# EAGLE schematic VDA (EAGLE 9.6.2)

## Sheet 1 of 5: Isolated USB-UART Bridge
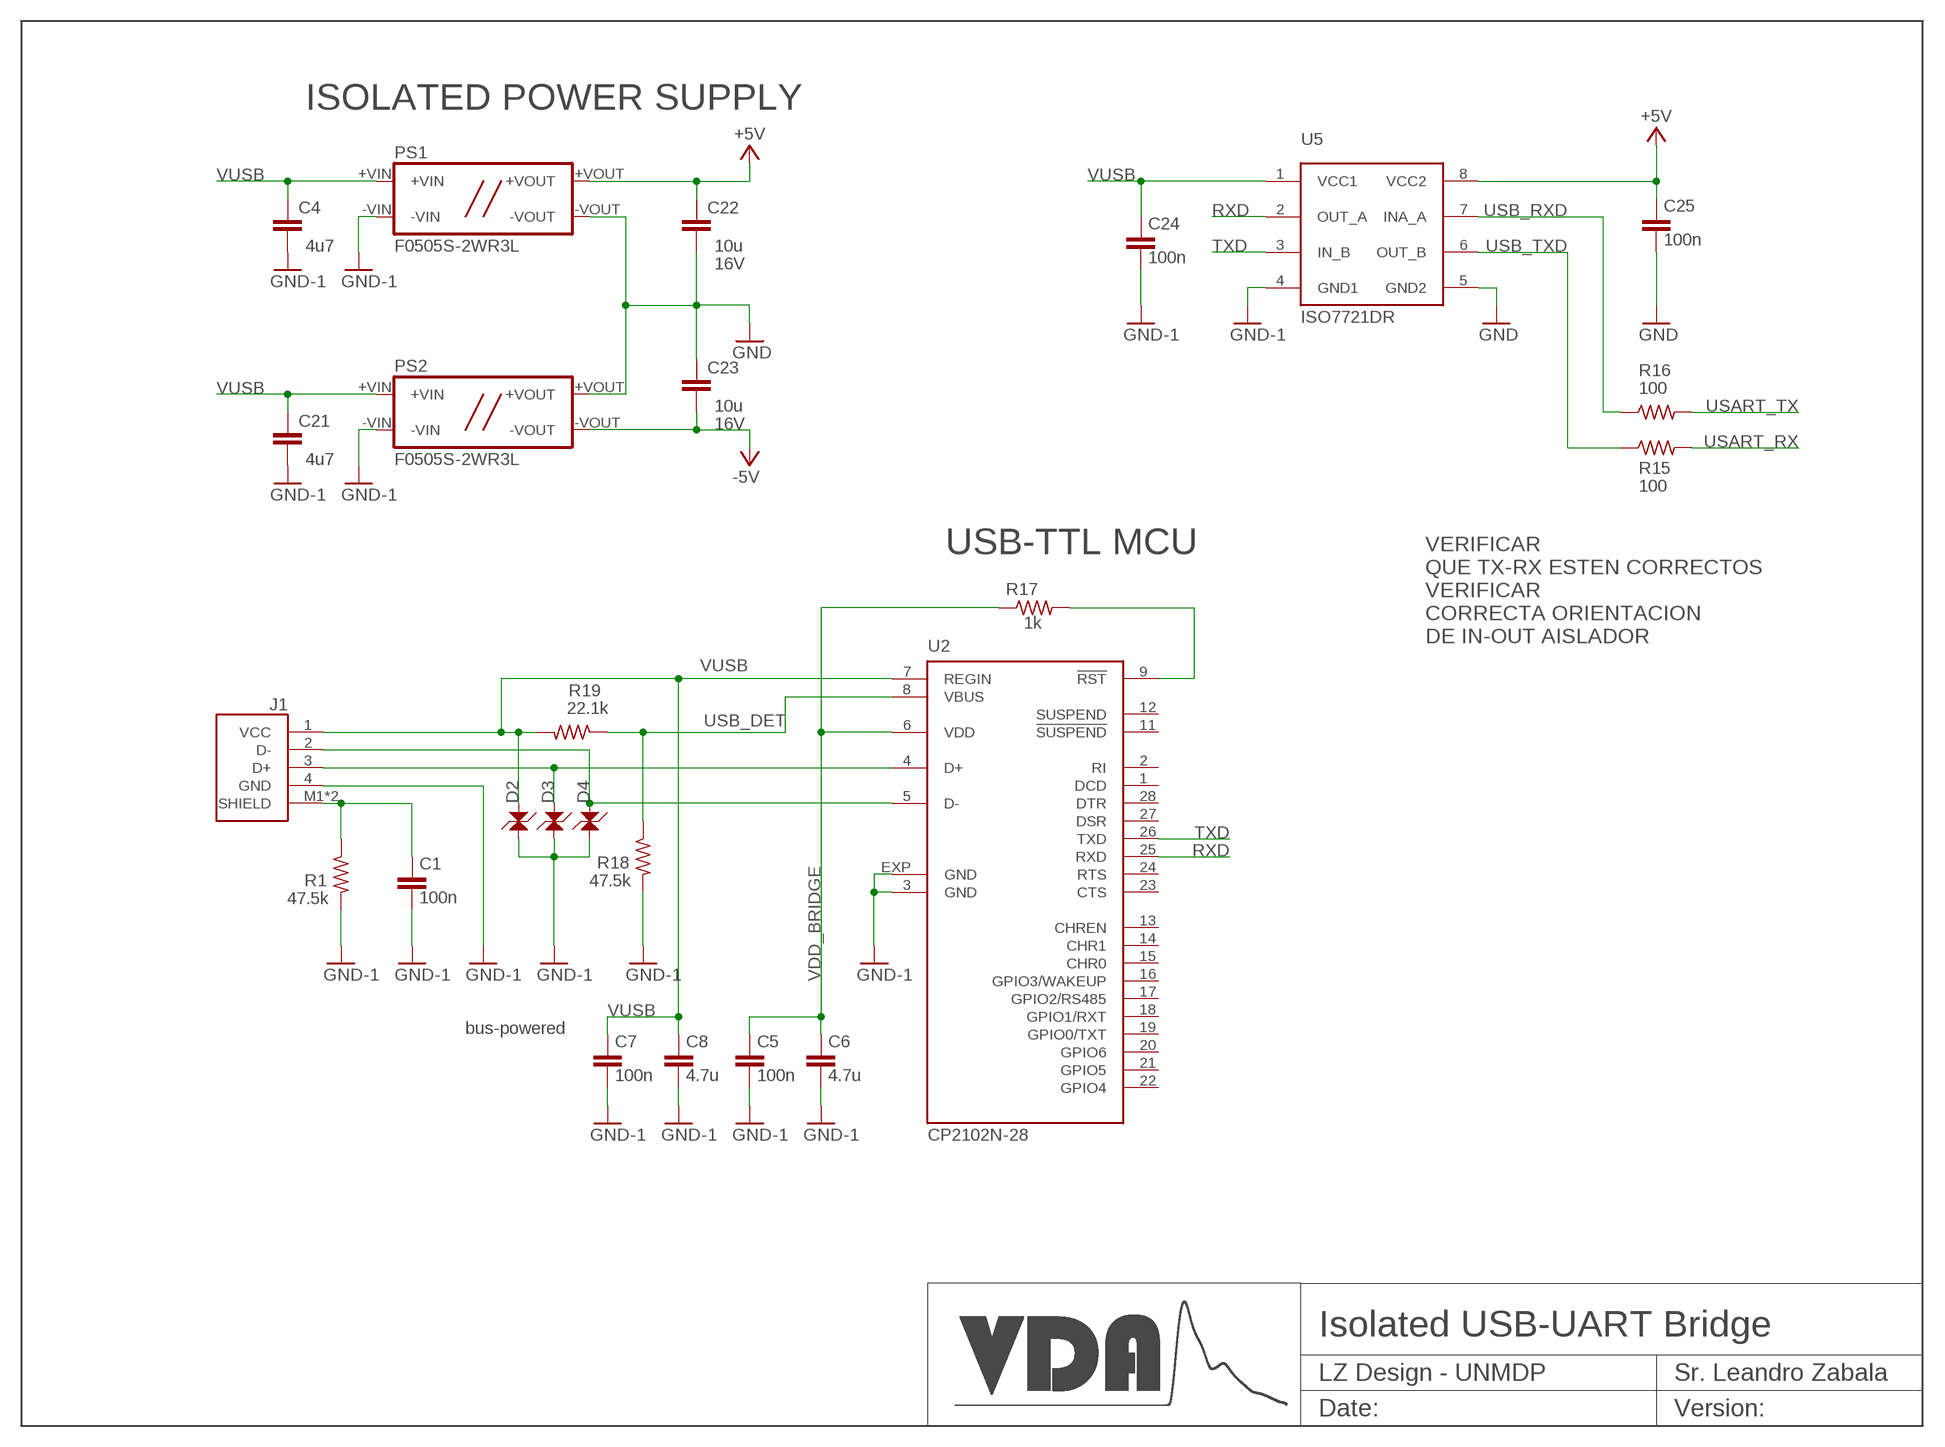
[diagram p0: schematic, sheet 1]

### Parts
C1  100n  C_0603  [C_0603]
C4  4u7  C_0603  [C_0603]
C5  100n  C_0603  [C_0603]
C6  4.7u  C_0805  [C_0805]
C7  100n  C_0603  [C_0603]
C8  4.7u  C_0805  [C_0805]
C21  4u7  C_0603  [C_0603]
C22  10u  C_0603  [C_0603]
C23  10u  C_0603  [C_0603]
C24  100n  C_0603  [C_0603]
C25  100n  C_0603  [C_0603]
D2  LESD5D5.0CT1G  [SOD523]
D3  LESD5D5.0CT1G  [SOD523]
D4  LESD5D5.0CT1G  [SOD523]
J1  USB-2.0  [USB-B]
PS1  F0505S-2WR3L  ISOLATED_DCDC  [0505S-2WR3]
PS2  F0505S-2WR3L  ISOLATED_DCDC  [0505S-2WR3]
R1  47.5k  R-US_R0402  [R0402]
R15  100  R_0603  [R_0603]
R16  100  R_0603  [R_0603]
R17  1k  R-US_R0402  [R0402]
R18  47.5k  R-US_R0402  [R0402]
R19  22.1k  R-US_R0402  [R0402]
U2  CP2102N-28  [MLP28]
U5  ISO7721DR  [SO8]

### Nets
+5V: C22.P$1 C25.P$1 PS1.+VOUT U5.8(VCC2) ; also sheet 2,4
-5V: C23.P$2 PS2.-VOUT ; also sheet 4
GND: C22.P$2 C23.P$1 C25.P$2 PS1.-VOUT PS2.+VOUT U5.5(GND2) ; also sheet 2,3,4
GND-1: C1.P$2 C4.P$2 C5.P$2 C6.P$2 C7.P$2 C8.P$2 C21.P$2 C24.P$2 D2.C D3.C D4.C J1.4(GND) PS1.-VIN PS2.-VIN R1.2 R18.2 U2.3(GND) U2.EXP(GND) U5.4(GND1)
N$54: R17.2 U2.9(!RST)
RXD: U2.25(RXD) U5.2(OUT_A)
SHIELD: C1.P$1 J1.M1(SHIELD) J1.M2(SHIELD) R1.1
TXD: U2.26(TXD) U5.3(IN_B)
USART_RX: R15.2 ; also sheet 3
USART_TX: R16.2 ; also sheet 3
USB_DET: R18.1 R19.1 U2.8(VBUS)
USB_DN: D4.A J1.2(D-) U2.5(D-)
USB_DP: D3.A J1.3(D+) U2.4(D+)
USB_RXD: R16.1 U5.7(INA_A)
USB_TXD: R15.1 U5.6(OUT_B)
VDD_BRIDGE: C5.P$1 C6.P$1 R17.1 U2.6(VDD)
VUSB: C4.P$1 C7.P$1 C8.P$1 C21.P$1 C24.P$1 D2.A J1.1(VCC) PS1.+VIN PS2.+VIN R19.2 U2.7(REGIN) U5.1(VCC1)
Unconnected: U2.1(DCD) U2.2(RI) U2.11(!SUSPEND) U2.12(SUSPEND) U2.13(CHREN) U2.14(CHR1) U2.15(CHR0) U2.16(GPIO3/WAKEUP) U2.17(GPIO2/RS485) U2.18(GPIO1/RXT) U2.19(GPIO0/TXT) U2.20(GPIO6) U2.21(GPIO5) U2.22(GPIO4) U2.23(CTS) U2.24(RTS) U2.27(DSR) U2.28(DTR)

### Notes on the sheet
- ISOLATED POWER SUPPLY
- USB-TTL MCU
- VERIFICAR 
  QUE TX-RX ESTEN CORRECTOS
  VERIFICAR
  CORRECTA ORIENTACION
  DE IN-OUT AISLADOR
- bus-powered

## Sheet 2 of 5: Power Supply and Voltage Reference
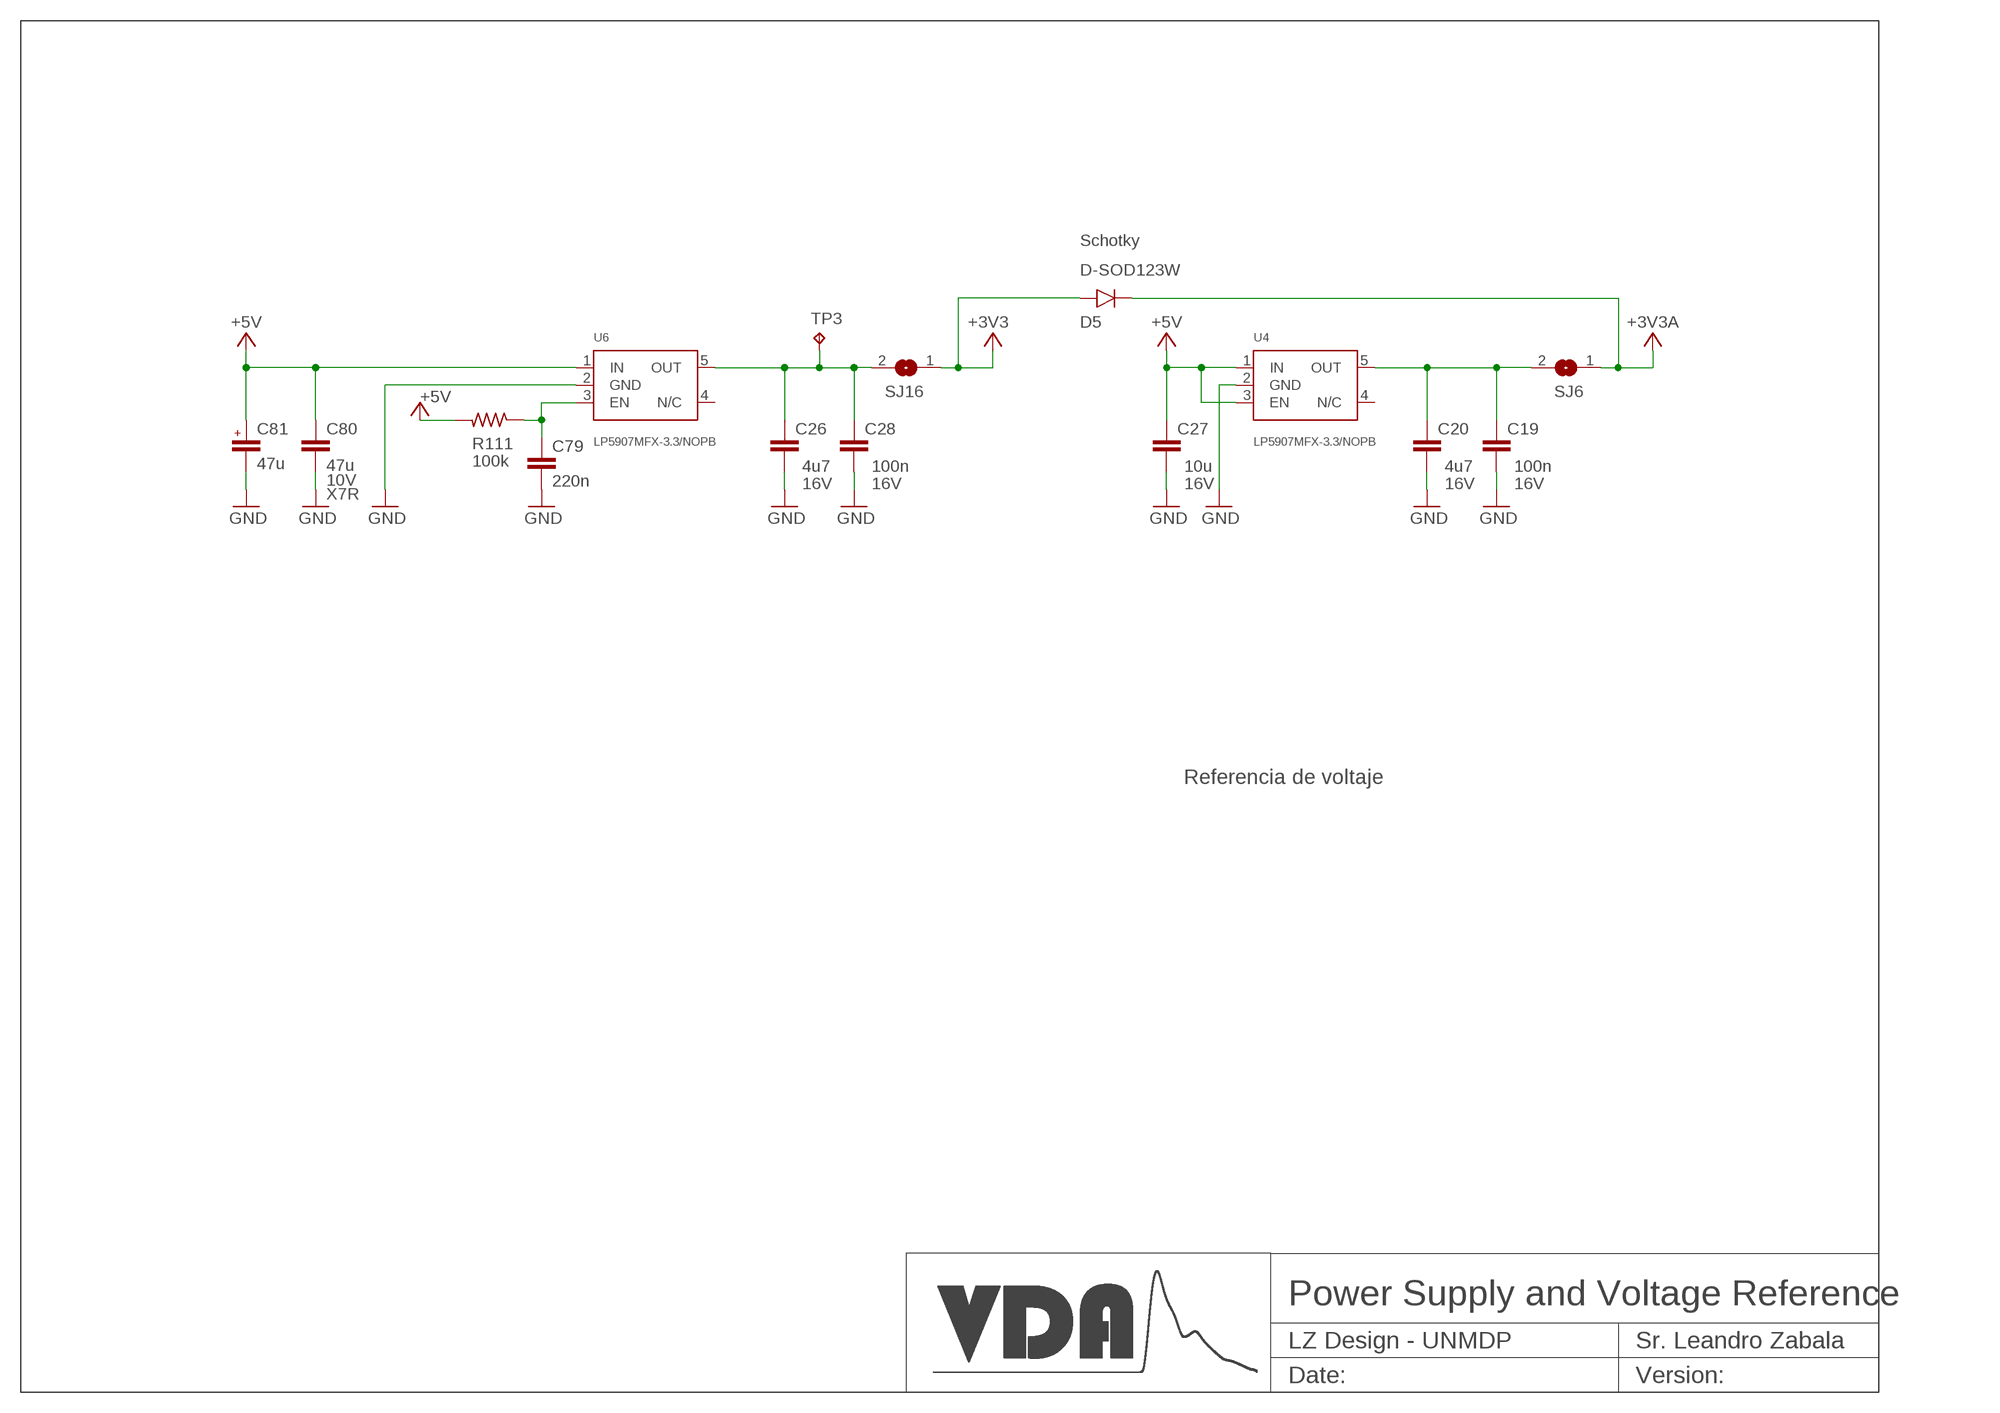
[diagram p1: schematic, sheet 2]

### Parts
C19  100n  C_0603  [C_0603]
C20  4u7  C_0603  [C_0603]
C26  4u7  C_0603  [C_0603]
C27  10u  C_0603  [C_0603]
C28  100n  C_0603  [C_0603]
C79  220n  C_0603  [C_0603]
C80  47u  C_1206  [C_1206]
C81  47u  C-TANTALUM_A_3216  [A_3216]
D5  D-SOD123W  [SOD123W]
R111  100k  R_0603  [R_0603]
SJ6  SJ  [SJ]
SJ16  SJ  [SJ]
TP3  TPB1,27  [B1,27]
U4  LP5907MFX-3.3/NOPB  LDO1SOT23-5_1  [SOT23-5]
U6  LP5907MFX-3.3/NOPB  LDO1SOT23-5_1  [SOT23-5]

### Nets
+3V3: D5.A SJ16.1 ; also sheet 3,5
+3V3A: D5.C(K) SJ6.1 ; also sheet 3
+5V: C27.P$1 C80.P$1 C81.A(+) R111.2 U4.1(IN) U4.3(EN) U6.1(IN) ; also sheet 1,4
GND: C19.P$2 C20.P$2 C26.P$2 C27.P$2 C28.P$2 C79.P$2 C80.P$2 C81.K(-) U4.2(GND) U6.2(GND) ; also sheet 1,3,4
N$1: C26.P$1 C28.P$1 SJ16.2 TP3.TP U6.5(OUT)
N$46: C79.P$1 R111.1 U6.3(EN)
N$50: C19.P$1 C20.P$1 SJ6.2 U4.5(OUT)
Unconnected: U4.4(N/C) U6.4(N/C)

### Notes on the sheet
- Referencia de voltaje

## Sheet 3 of 5: MCU
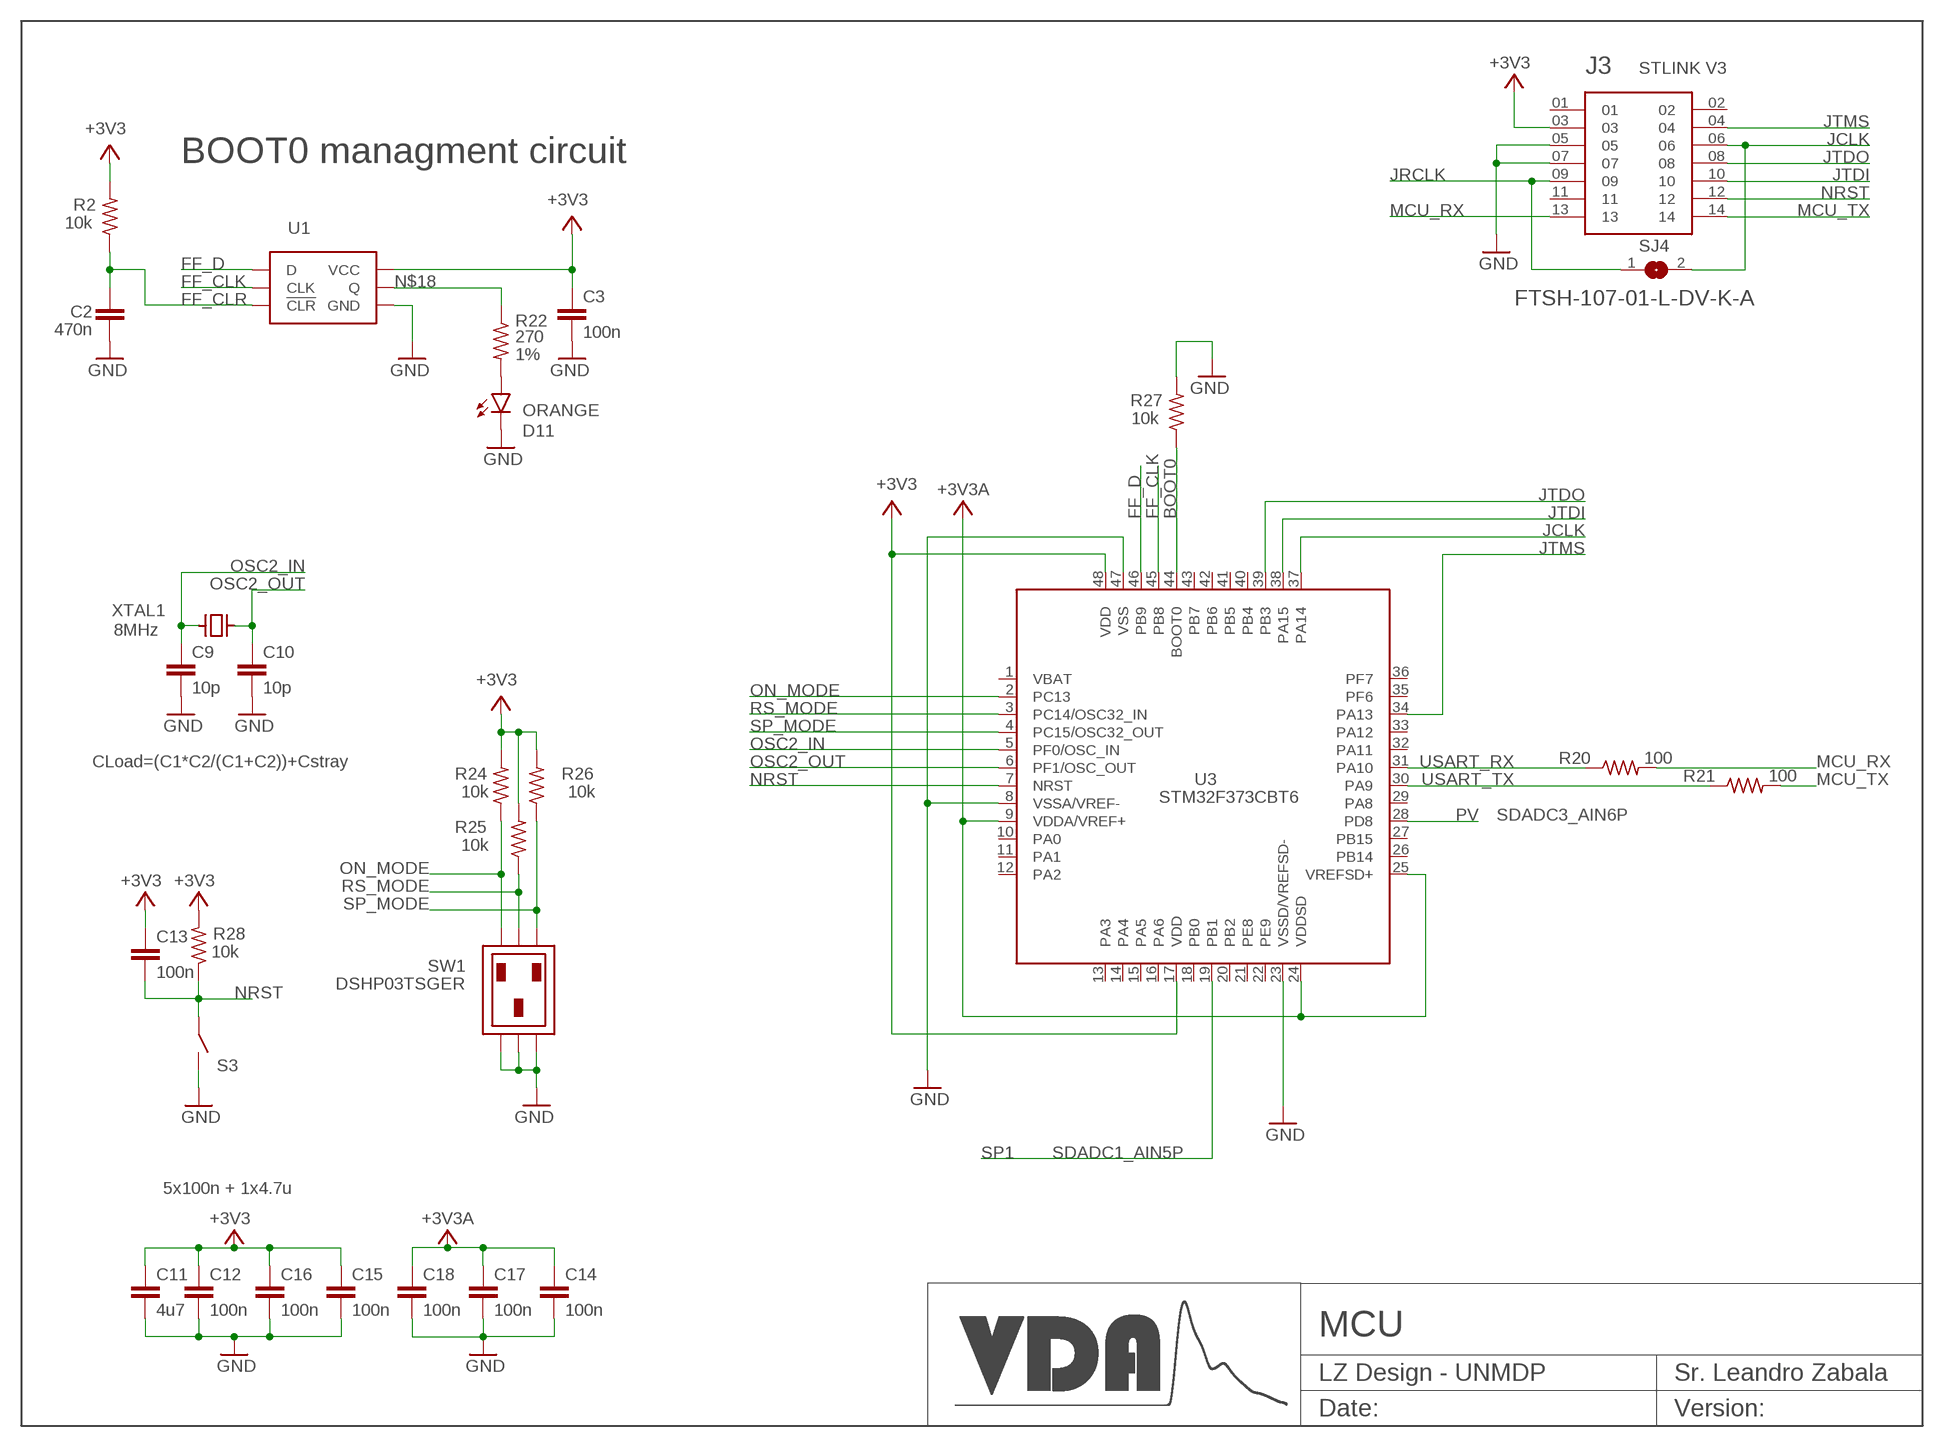
[diagram p2: schematic, sheet 3]

### Parts
C2  470n  C_0603  [C_0603]
C3  100n  C_0603  [C_0603]
C9  10p  C_0603  [C_0603]
C10  10p  C_0603  [C_0603]
C11  4u7  C_0805  [C_0805]
C12  100n  C_0603  [C_0603]
C13  100n  C_0603  [C_0603]
C14  100n  C_0603  [C_0603]
C15  100n  C_0603  [C_0603]
C16  100n  C_0603  [C_0603]
C17  100n  C_0603  [C_0603]
C18  100n  C_0603  [C_0603]
D11  ORANGE  LED_0603_ARROW  [LED_0603_ARROW]
J3  FTSH-107-01-L-DV-K-A  [SAMTEC_FTSH-107-01-L-DV-K-A]
R2  10k  R_0603  [R_0603]
R20  100  R_0603  [R_0603]
R21  100  R_0603  [R_0603]
R22  270  R_0402  [R_0402]
R24  10k  R_0603  [R_0603]
R25  10k  R_0603  [R_0603]
R26  10k  R_0603  [R_0603]
R27  10k  R_0603  [R_0603]
R28  10k  R_0603  [R_0603]
S3  TSWITCH_SMTR2  [SMTR2]
SJ4  SJ  [SJ]
SW1  DSHP03TSGER  DIPSW-3  [DIPSW-3]
U1  SN74LVC1G175  [SOT-23-6]
U3  STM32F373CBT6  STM32F373-48CT  [QFP50P900X900X160-48N]
XTAL1  8MHz  XTAL3.2X2.5  [XTAL3.2X2.5]

### Nets
+3V3: C3.P$1 C11.P$1 C12.P$1 C13.P$1 C15.P$1 C16.P$1 J3.03 R2.2 R24.2 R25.2 R26.2 R28.2 U1.5(VCC) U3.17(VDD) U3.48(VDD) ; also sheet 2,5
+3V3A: C14.P$1 C17.P$1 C18.P$1 U3.9(VDDA/VREF+) U3.24(VDDSD) U3.25(VREFSD+) ; also sheet 2
BOOT0: R27.1 U3.44(BOOT0)
FF_CLK: U1.1(CLK) U3.45(PB8)
FF_CLR: C2.P$1 R2.1 U1.6(!CLR!)
FF_D: U1.3(D) U3.46(PB9)
GND: C2.P$2 C3.P$2 C9.P$2 C10.P$2 C11.P$2 C12.P$2 C14.P$2 C15.P$2 C16.P$2 C17.P$2 C18.P$2 D11.K J3.05 J3.07 R27.2 S3.P$3 S3.P$4 SW1.P$2 SW1.P$4 SW1.P$6 U1.2(GND) U3.8(VSSA/VREF-) U3.23(VSSD/VREFSD-) U3.47(VSS) ; also sheet 1,2,4
JCLK: J3.06 SJ4.2 U3.37(PA14)
JRCLK: J3.09 SJ4.1
JTDI: J3.10 U3.38(PA15)
JTDO: J3.08 U3.39(PB3)
JTMS: J3.04 U3.34(PA13)
MCU_RX: J3.13 R20.2
MCU_TX: J3.14 R21.2
N$15: D11.A R22.2
N$18: R22.1 U1.4(Q)
NRST: C13.P$2 J3.12 R28.1 S3.P$1 S3.P$2 U3.7(NRST)
ON_MODE: R24.1 SW1.P$1 U3.2(PC13)
OSC2_IN: C9.P$1 U3.5(PF0/OSC_IN) XTAL1.P$3(X2)
OSC2_OUT: C10.P$1 U3.6(PF1/OSC_OUT) XTAL1.P$1(X1)
PV: U3.28(PD8)
RS_MODE: R25.1 SW1.P$3 U3.3(PC14/OSC32_IN)
SP1: U3.19(PB1)
SP_MODE: R26.1 SW1.P$5 U3.4(PC15/OSC32_OUT)
USART_RX: R20.1 U3.31(PA10) ; also sheet 1
USART_TX: R21.1 U3.30(PA9) ; also sheet 1
Unconnected: J3.01 J3.02 J3.11 U3.10(PA0) U3.11(PA1) U3.12(PA2) U3.13(PA3) U3.14(PA4) U3.15(PA5) U3.16(PA6) U3.18(PB0) U3.20(PB2) U3.21(PE8) U3.22(PE9) U3.26(PB14) U3.27(PB15) U3.29(PA8) U3.32(PA11) U3.33(PA12) U3.35(PF6) U3.36(PF7) U3.40(PB4) U3.41(PB5) U3.42(PB6) U3.43(PB7)

### Notes on the sheet
- STLINK V3
- BOOT0 managment circuit
- CLoad=(C1*C2/(C1+C2))+Cstray
- SDADC3_AIN6P
- SDADC1_AIN5P
- 5x100n + 1x4.7u

## Sheet 4 of 5: Front End
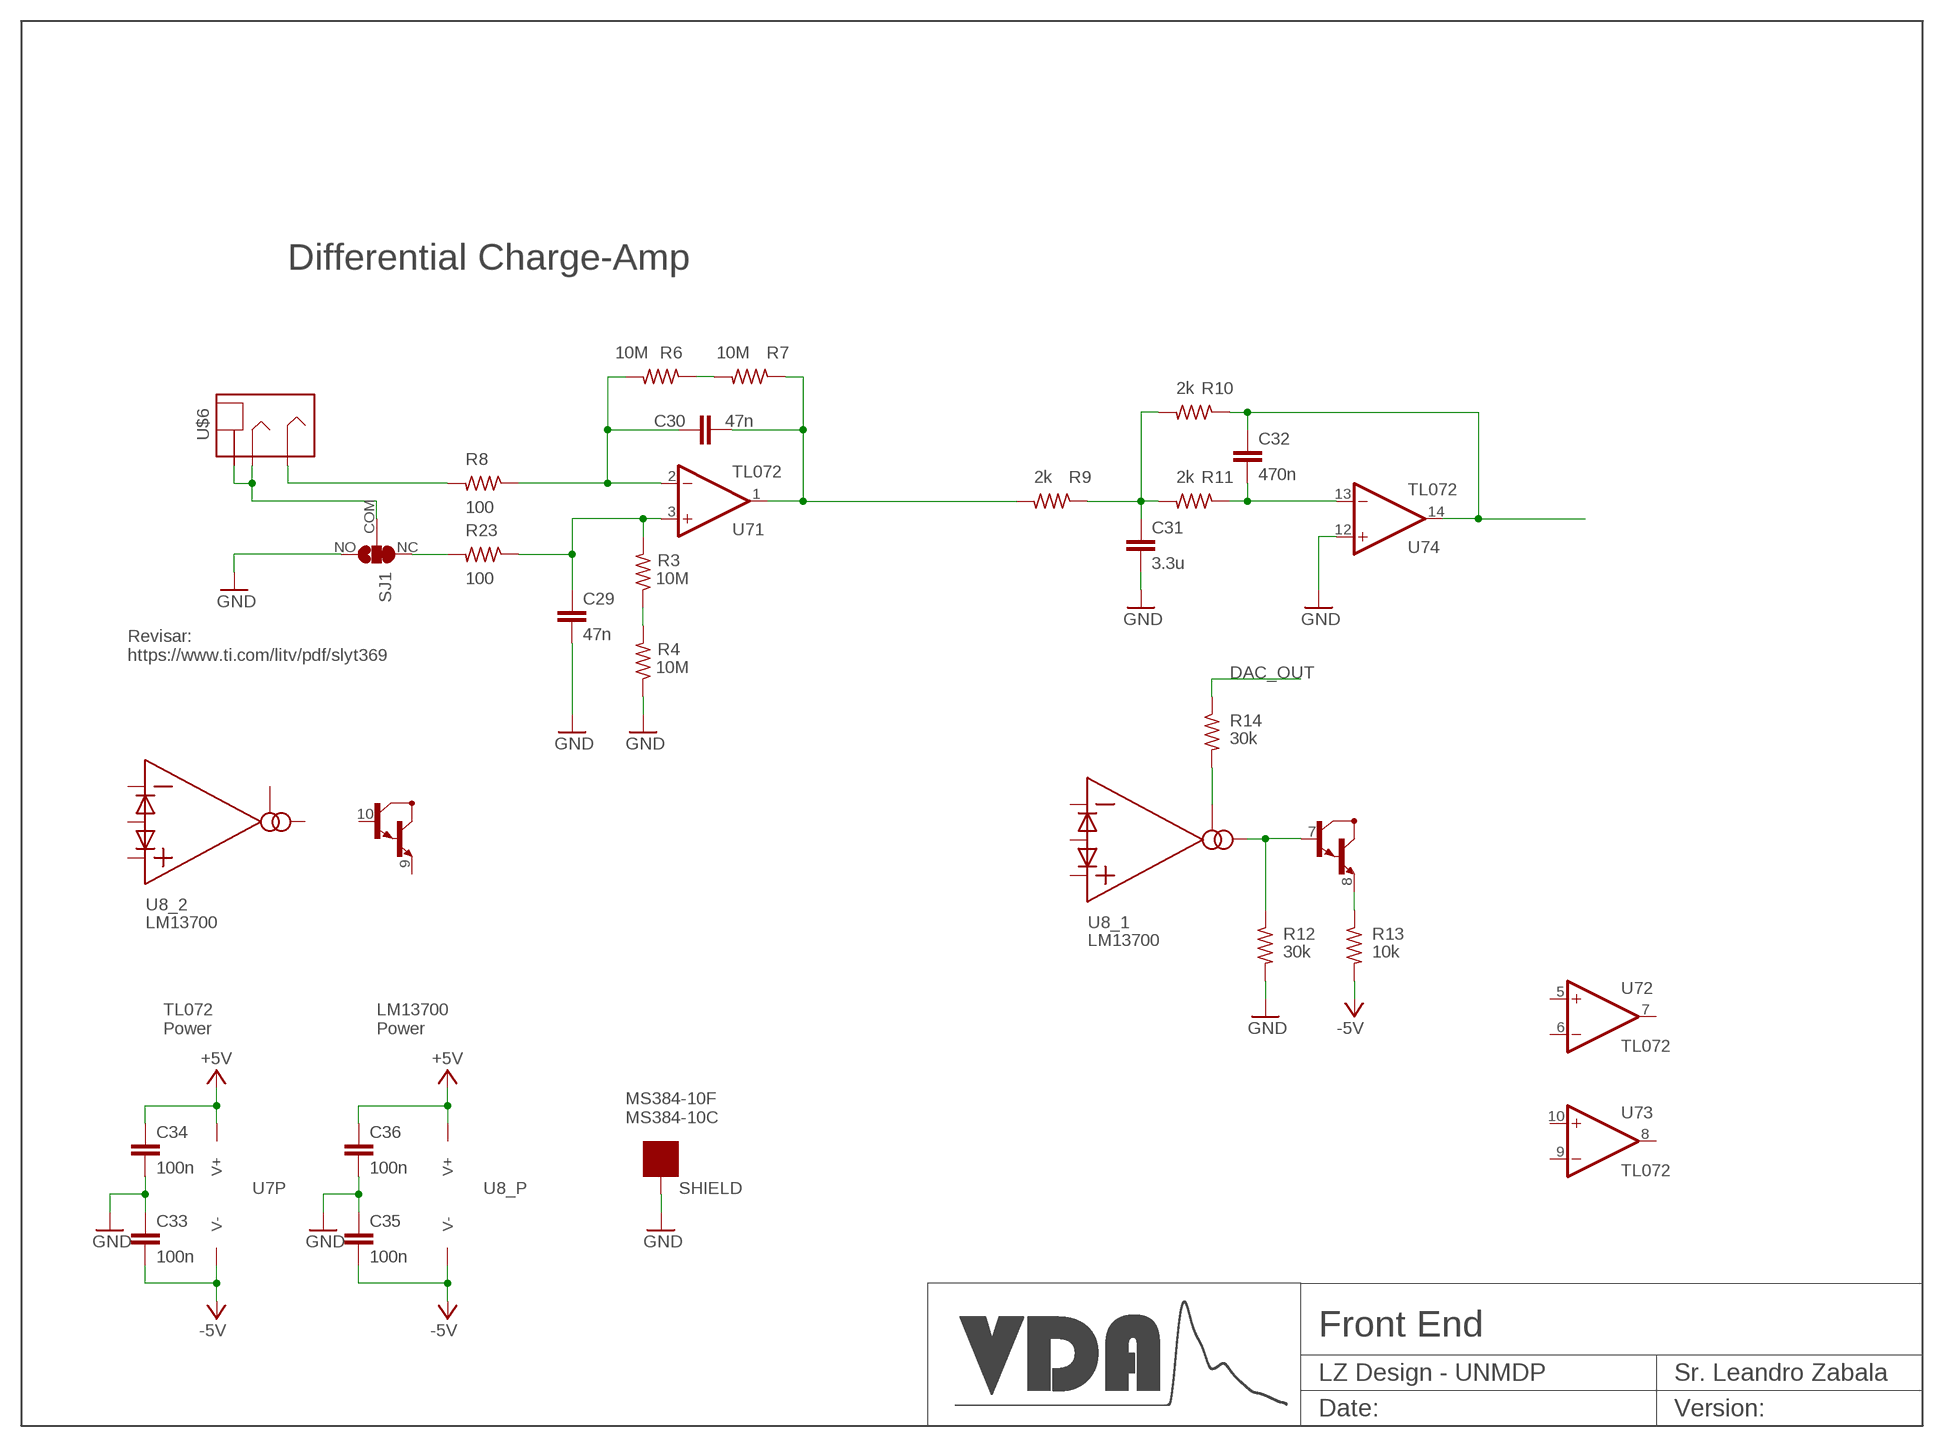
[diagram p3: schematic, sheet 4]

### Parts
C29  47n  C_0603  [C_0603]
C30  47n  C_0603  [C_0603]
C31  3.3u  C_0603  [C_0603]
C32  470n  C_0603  [C_0603]
C33  100n  C_0603  [C_0603]
C34  100n  C_0603  [C_0603]
C35  100n  C_0603  [C_0603]
C36  100n  C_0603  [C_0603]
R3  10M  R_0603  [R_0603]
R4  10M  R_0603  [R_0603]
R6  10M  R_0603  [R_0603]
R7  10M  R_0603  [R_0603]
R8  100  R_0603  [R_0603]
R9  2k  R_0603  [R_0603]
R10  2k  R_0603  [R_0603]
R11  2k  R_0603  [R_0603]
R12  30k  R_0603  [R_0603]
R13  10k  R_0603  [R_0603]
R14  30k  R_0603  [R_0603]
R23  100  R_0603  [R_0603]
SHIELD  MS384  [MS384]
SJ1  SJ-PS  [SJ_2]
U7  TL072  LM324BD  [SOIC127P600X175-14N]
U8  LM13700  [SO16]
U$6  STEREO-JACK  [PJ-3200]

### Nets
+5V: C34.P$1 C36.P$1 U7.4(P:V+) U8.11(_P:V+) ; also sheet 1,2
-5V: C33.P$2 C35.P$2 R13.2 U7.11(P:V-) U8.6(_P:V-) ; also sheet 1
DAC_OUT: R14.1
GND: C29.P$2 C31.P$2 C33.P$1 C34.P$2 C35.P$1 C36.P$2 R4.1 R12.2 SHIELD.P$1 SHIELD.P$2 SJ1.NO U7.12(4:+IN) ; also sheet 1,2,3
GND1: C30.P$2 R7.1 R9.2 U7.1(1:OUT)
N$2: C29.P$1 R3.2 R23.1 U7.3(1:+IN)
N$3: R3.1 R4.2
N$4: C30.P$1 R6.2 R8.1 U7.2(1:-IN)
N$5: R6.1 R7.2
N$6: SJ1.COM U$6.1(SLEEVE) U$6.3(RING)
N$7: C31.P$1 R9.1 R10.2 R11.2
N$9: R12.1 U8.5(_1:OUT) U8.7(_1:B)
N$10: C32.P$1 R10.1 U7.14(4:OUT)
N$11: C32.P$2 R11.1 U7.13(4:-IN)
N$12: R13.1 U8.8(_1:E)
N$13: R14.2 U8.1(_1:AMP_BIAS)
N$16: R8.2 U$6.2(TIP)
N$17: R23.2 SJ1.NC
Unconnected: U7.5(2:+IN) U7.6(2:-IN) U7.7(2:OUT) U7.8(3:OUT) U7.9(3:-IN) U7.10(3:+IN) U8.2(_1:D_BIAS) U8.3(_1:+) U8.4(_1:-) U8.9(_2:E) U8.10(_2:B) U8.12(_2:OUT) U8.13(_2:-) U8.14(_2:+) U8.15(_2:D_BIAS) U8.16(_2:AMP_BIAS)

### Notes on the sheet
- Differential Charge-Amp
- Revisar:
  https://www.ti.com/litv/pdf/slyt369
- TL072
  Power
- LM13700
  Power
- MS384-10F
  MS384-10C

## Sheet 5 of 5: Indicators
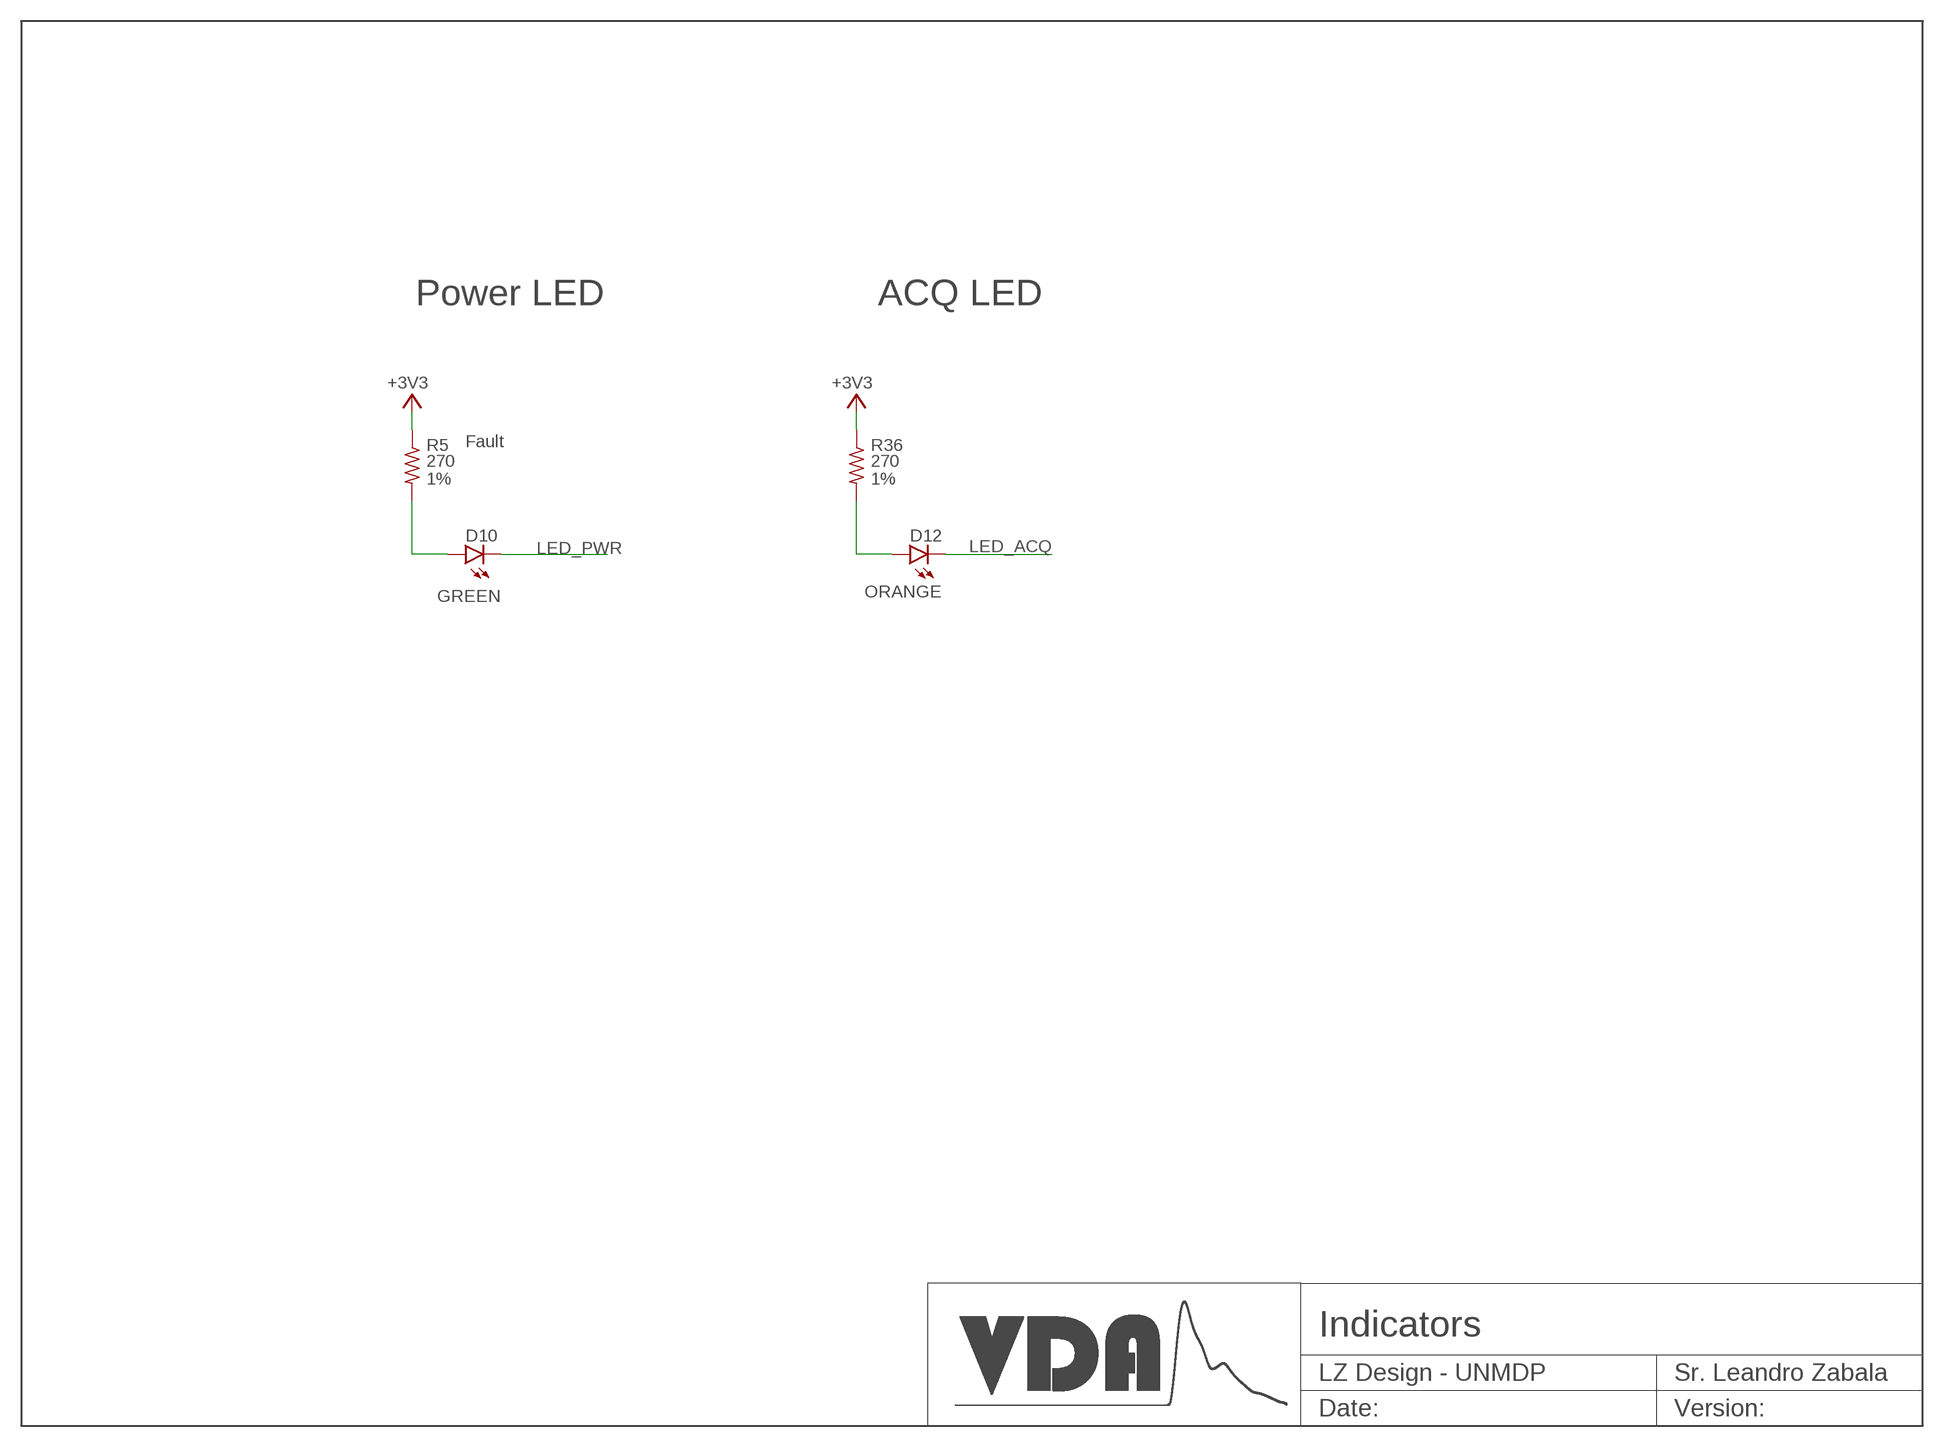
[diagram p4: schematic, sheet 5]

### Parts
D10  GREEN  LED_0603_ARROW  [LED_0603_ARROW]
D12  ORANGE  LED_0603_ARROW  [LED_0603_ARROW]
R5  270  R_0402  [R_0402]
R36  270  R_0402  [R_0402]

### Nets
+3V3: R5.1 R36.1 ; also sheet 2,3
LED_ACQ: D12.K
LED_PWR: D10.K
N$8: D12.A R36.2
N$14: D10.A R5.2

### Notes on the sheet
- Power LED | ACQ LED
- Fault

## Power pins joined to a net without a drawn wire
VBAT: U3.1(VBAT)

## Library data of the parts
C1-C3 C5-C18 C24 C25 C29-C36 C79 = Property-standar:C
C4 C19-C23 C26-C28 = Property-standar:C; V: 16V
C80 = Property-standar:C; D: X7R; ESR: LOW; V: 10V
C81 = Property-standar:C-TANTALUM
D2-D4 = property:LESD5D5.0CT1G
D5 = Property-standar:D; TYPE: Schotky
D10-D12 = Property-standar:LED
J1 = Connectors:USB-2.0
J3 = property-connectors:FTSH-107-01-L-DV-K-A: High Reliability Header Strips, 0.050" pitch; MANUFACTURER: Samtec; MAXIMUM_PACKAGE_HEIGHT: 6.23mm; PARTREV: H; STANDARD: Manufacturer Recommendation
PS1 PS2 = Power-Supply:ISOLATED_DCDC
R1 R17-R19 = resistor:R-US_: RESISTOR, American symbol
R2-R4 R6-R16 R20 R21 R23-R28 R111 = Property-standar:R
R5 R22 R36 = Property-standar:R; TOL: 1%
S3 = property:TSWITCH
SHIELD = shields:MS384
SJ1 = property-pads:SJ-PS: SMD solder JUMPER
SJ4 SJ6 SJ16 = jumper:SJ: SMD solder JUMPER
SW1 = properti-mechanical:DIPSW-3
TP3 = testpad:TP: Test pad
U1 = property_digital:SN74LVC1G175
U2 = property:CP2102N-28
U3 = property:STM32F373-48
U4 U6 = property-power:LDO1
U5 = property_digital:ISO7721DR
U7 = property:LM324B: OP AMP also LM158; LM258; LM2904 Source: http://cache.national.com/ds/LM/LM158.pdf
U8 = property_analog:LM13700
U$6 = Connectors:STEREO-JACK
XTAL1 = property:XTAL; MPN: 830108313809